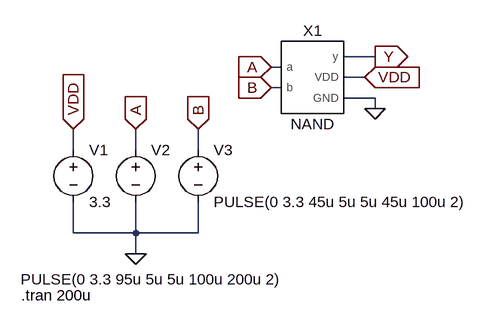
[diagram p0: schematic nand_test.asc]
nand_test.asc, the LTspice schematic file:
Version 4.1
SHEET 1 880 680
WIRE 288 96 240 96
WIRE 144 112 128 112
WIRE 272 128 240 128
WIRE 144 144 128 144
WIRE 288 160 240 160
WIRE 288 176 288 160
WIRE -176 240 -176 208
WIRE -80 240 -80 208
WIRE 16 240 16 208
WIRE -176 368 -176 320
WIRE -80 368 -80 320
WIRE -80 368 -176 368
WIRE 16 368 16 320
WIRE 16 368 -80 368
WIRE -80 400 -80 368
FLAG -80 400 0
FLAG -176 208 VDD
IOPIN -176 208 In
FLAG -80 208 A
IOPIN -80 208 In
FLAG 16 208 B
IOPIN 16 208 In
FLAG 128 112 A
IOPIN 128 112 In
FLAG 128 144 B
IOPIN 128 144 In
FLAG 288 96 Y
IOPIN 288 96 Out
FLAG 288 176 0
FLAG 272 128 VDD
IOPIN 272 128 In
SYMBOL voltage -176 224 R0
WINDOW 123 0 0 Left 0
WINDOW 39 0 0 Left 0
SYMATTR InstName V1
SYMATTR Value 3.3
SYMBOL voltage -80 224 R0
WINDOW 3 -177 215 Left 2
WINDOW 123 0 0 Left 0
WINDOW 39 0 0 Left 0
SYMATTR Value PULSE(0 3.3 95u 5u 5u 100u 200u 2)
SYMATTR InstName V2
SYMBOL voltage 16 224 R0
WINDOW 123 0 0 Left 0
WINDOW 39 0 0 Left 0
SYMATTR InstName V3
SYMATTR Value PULSE(0 3.3 45u 5u 5u 45u 100u 2)
SYMBOL nand 192 128 R0
SYMATTR InstName X1
TEXT -256 464 Left 2 !.tran 200u

The netlist it stands for:
* nand_test.asc
V1 VDD 0 3.3
V2 A 0 PULSE(0 3.3 95u 5u 5u 100u 200u 2)
V3 B 0 PULSE(0 3.3 45u 5u 5u 45u 100u 2)
X§X1 A B Y VDD 0 NAND NAND  ; pins a b y VDD GND
.tran 200u
.lib yap_cells.lib
.backanno
.end